# Altium schematic sheet ADS1118IDGSR_C55347ADS1118IDGSR_C55347.schdoc
size 127 x 101 mm
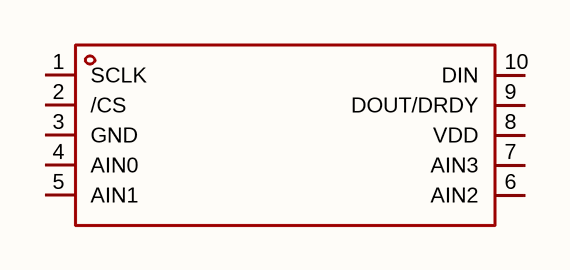
[diagram p0: ADS1118IDGSR_C55347ADS1118IDGSR_C55347.schdoc]

## Parts
U?  (no value)

## Nets

Not connected (* = marked no-connect by the designer): U? 1(SCLK) 2(/CS) 3(GND) 4(AIN0) 5(AIN1) 6(AIN2) 7(AIN3) 8(VDD) 9(DOUT/DRDY) 10(DIN)

## Library data of the parts
U? = ADS1118IDGSR_C55347: Symbol: ADS1118IDGSR_C55347